# Altium schematic sheet main.SchDoc
size A
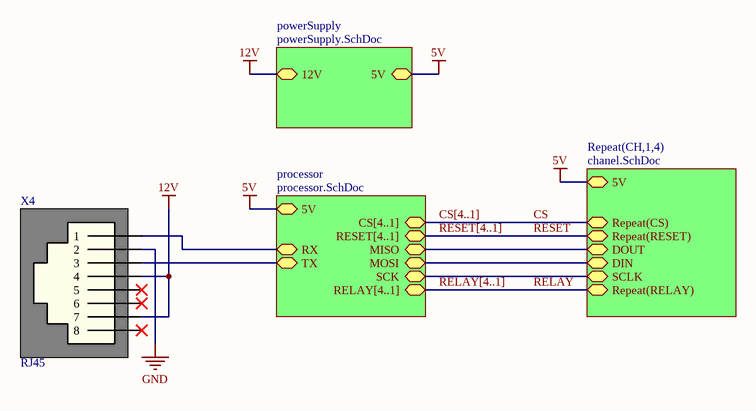
[diagram p0: main.SchDoc]

## Parts
X4  RJ45  [RJ45]

## Sub-sheets
powerSupply = powerSupply.SchDoc: 5V, 12V
processor = processor.SchDoc: MISO, RELAY[4..1], RESET[4..1], CS[4..1], MOSI, SCK, RX, TX, 5V
Repeat(CH,1,4) = chanel.SchDoc: Repeat(CS), Repeat(RESET), DOUT, DIN, SCLK, Repeat(RELAY), 5V

## Nets
5V: sheet Repeat(CH,1,4)/5V, sheet processor/5V, sheet powerSupply/5V
12V: X4.4 X4.7 ; sheet powerSupply/12V
GND: X4.2
CS: sheet Repeat(CH,1,4)/Repeat(CS)
RELAY: sheet Repeat(CH,1,4)/Repeat(RELAY)
RESET: sheet Repeat(CH,1,4)/Repeat(RESET)
NetX4_1: X4.1 ; sheet processor/RX
NetX4_3: X4.3 ; sheet processor/TX
(unnamed): sheet Repeat(CH,1,4)/DOUT, sheet processor/MISO
(unnamed): sheet Repeat(CH,1,4)/DIN, sheet processor/MOSI
(unnamed): sheet Repeat(CH,1,4)/SCLK, sheet processor/SCK

Not connected (* = marked no-connect by the designer): X4 5* 6* 8*

## Buses and harness runs
bus CS[4..1] = sheet processor/CS[4..1]
bus RELAY[4..1] = sheet processor/RELAY[4..1]
bus RESET[4..1] = sheet processor/RESET[4..1]

## Library data of the parts
X4 = RJ45: Outlet YH-55-05 8P8C 5521; Link: https://www.rcscomponents.kiev.ua/product/rozetka-yh-55-05-8p8c-5521-l-kls12-133-8p8c-w-o-2-01_8324.html